# EAGLE schematic 526_AI_BLOCKS_Rev020001 (EAGLE 9.6.2)
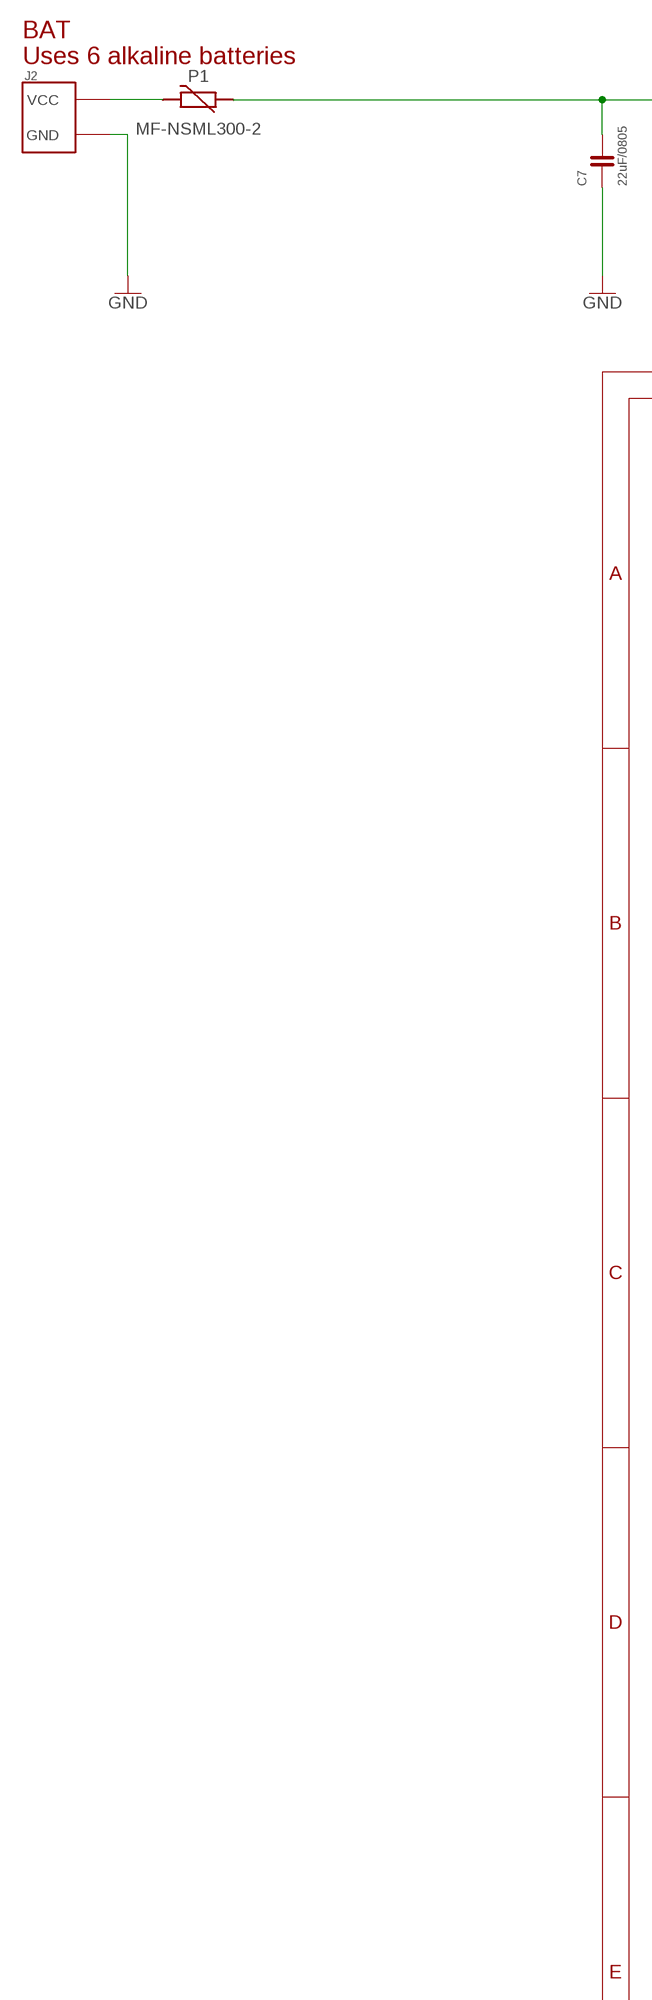
[diagram p0: schematic, sheet 1, part 1 of 2]
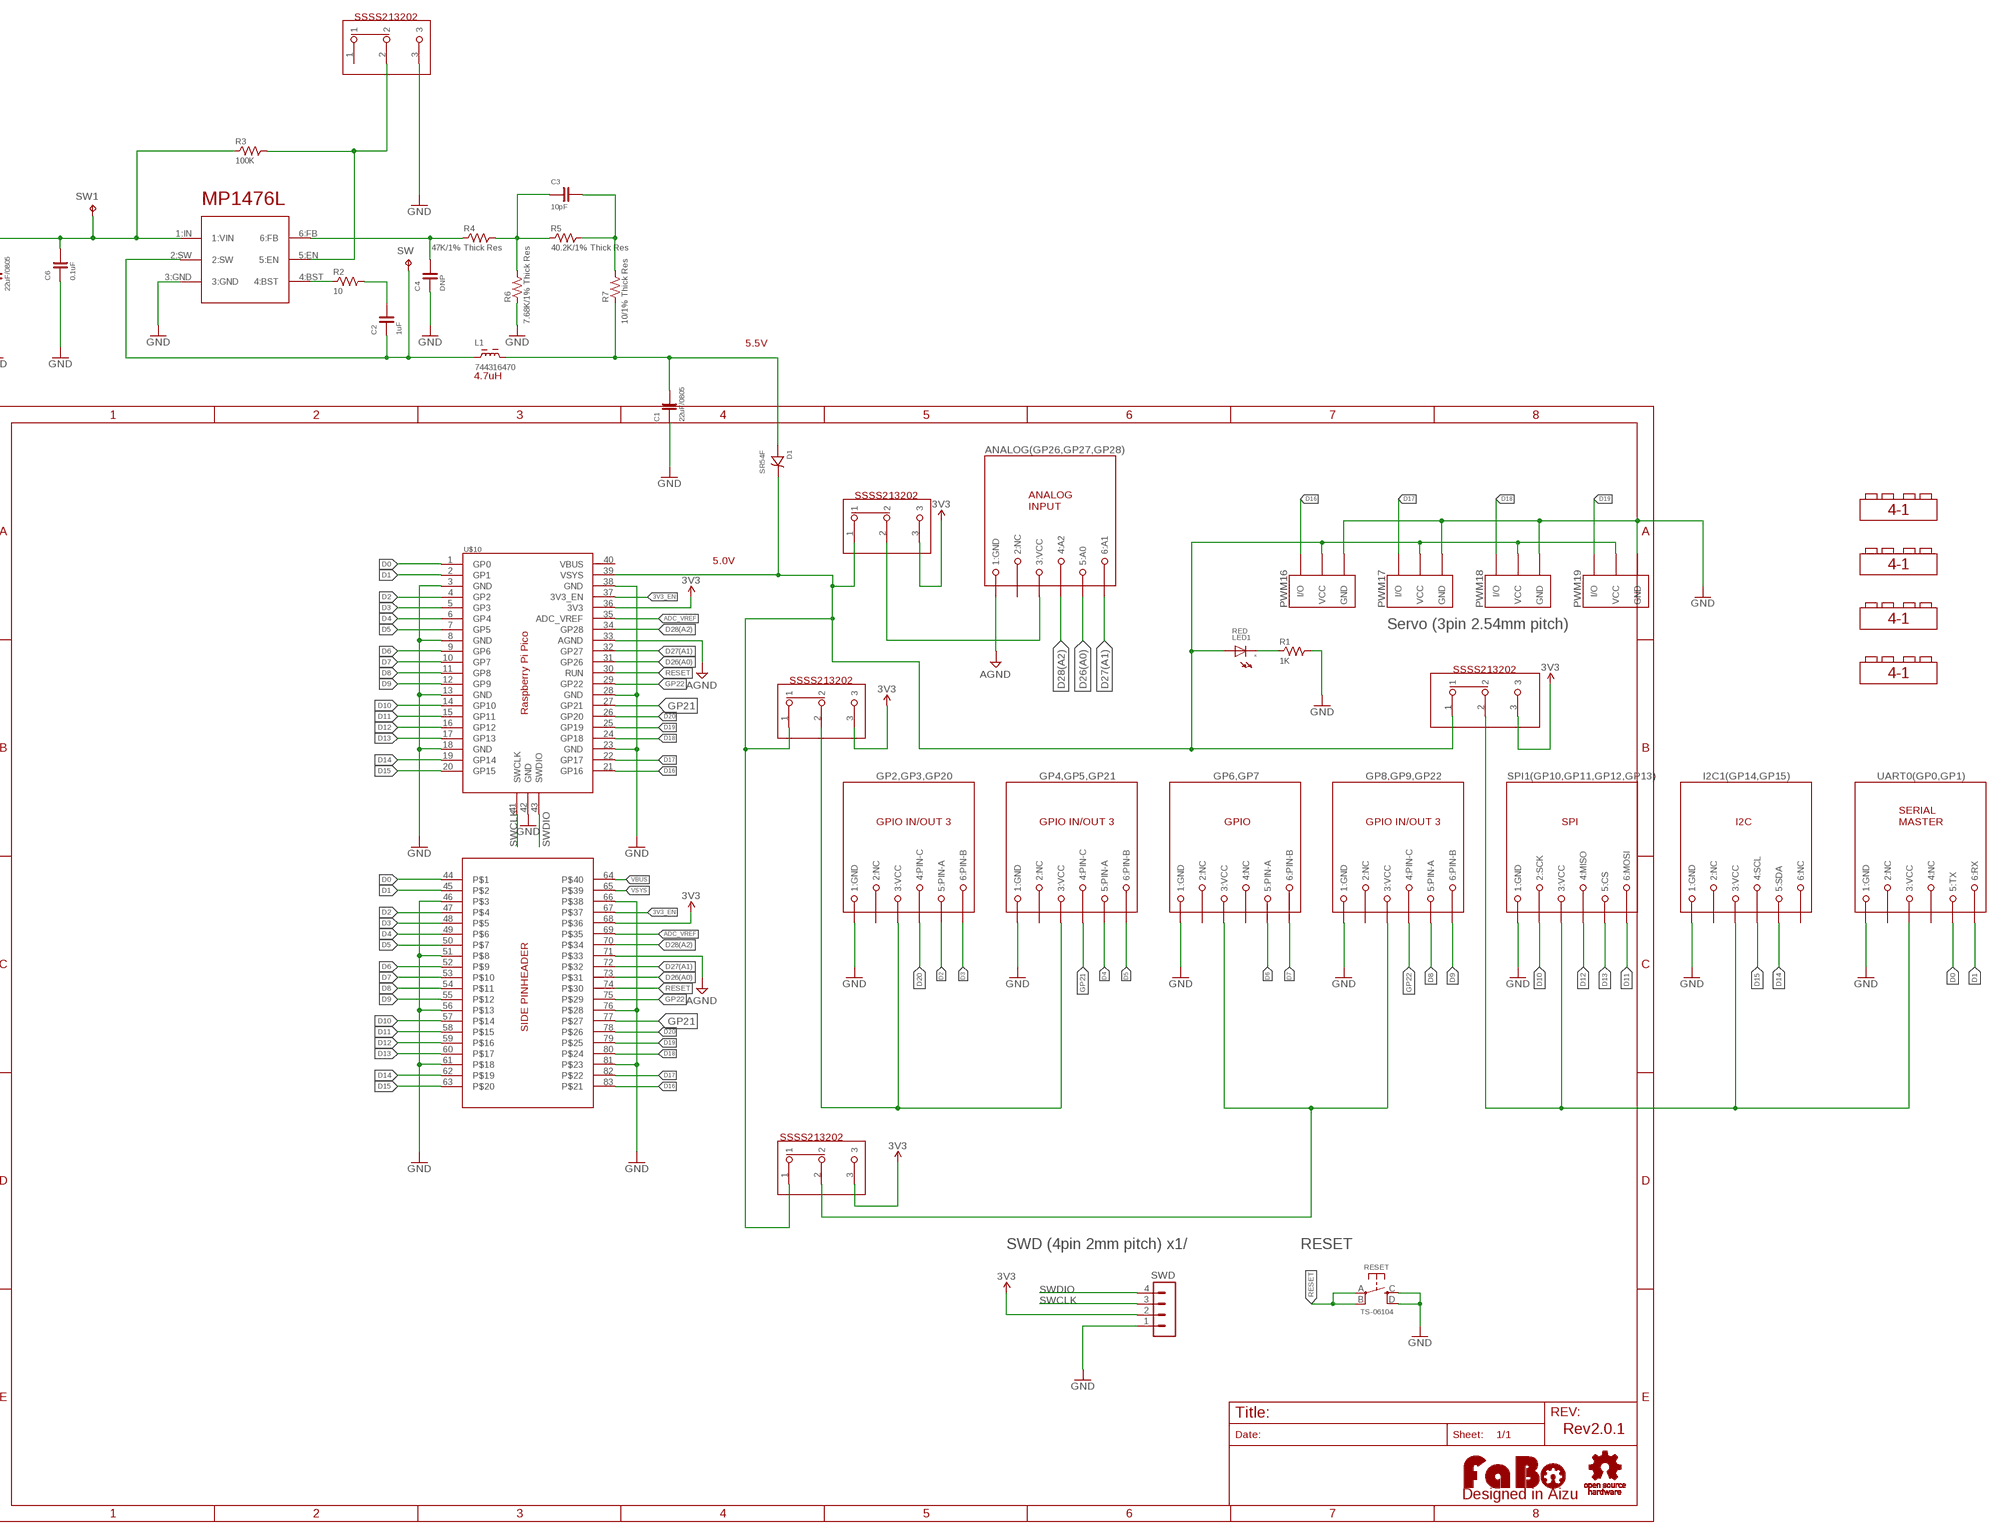
[diagram p1: schematic, sheet 1, part 2 of 2]

## Parts
ANALOG(GP26,GP27,GP28)  MODULAR-JACK-6P-RJ11_ANALOG3  [7002-6PXC-X]
C1  22uF/0805  CAPACITOR-0805  [0805]
C2  1uF  CAPACITOR-0603  [0603]
C3  10pF  CAPACITOR-0603  [0603]
C4  DNP  CAPACITOR-0603  [0603]
C6  0.1uF  CAPACITOR-0603  [0603]
C7  22uF/0805  CAPACITOR-0805  [0805]
D1  SR54F  [SMBF]
GP2,GP3,GP20  MODULAR-JACK-6P-RJ11_GPIO3  [7002-6PXC-X]
GP4,GP5,GP21  MODULAR-JACK-6P-RJ11_GPIO3  [7002-6PXC-X]
GP6,GP7  MODULAR-JACK-6P-RJ11_GPIO  [7002-6PXC-X]
GP8,GP9,GP22  MODULAR-JACK-6P-RJ11_GPIO3  [7002-6PXC-X]
I2C1(GP14,GP15)  MODULAR-JACK-6P-RJ11_I2C  [7002-6PXC-X]
J2  FABO_BRICK_2PIN  [FABO_BRICK_2PIN_B02B-PASK-1_SILK]
L1  744316470  [744316470]
LED1  RED  LED-0603  [0603]
LOGO1  LOGO_OSHW-M_BOTTOM  [LOGO_OSHW_M_BOTTOM]
LOGO2  LOGO_FABO-M  [LOGO_FABO_M]
P1  MF-NSML300-2  POLYSWITCH1206  [1206]
PWM16  FABO_BRICK_3PIN-HEADER  [FABO_BRICK_3PIN_HEADER]
PWM17  FABO_BRICK_3PIN-HEADER  [FABO_BRICK_3PIN_HEADER]
PWM18  FABO_BRICK_3PIN-HEADER  [FABO_BRICK_3PIN_HEADER]
PWM19  FABO_BRICK_3PIN-HEADER  [FABO_BRICK_3PIN_HEADER]
R1  1K  RESISTOR-0603  [0603]
R2  10  RESISTOR-0603  [0603]
R3  100K  RESISTOR-0603  [0603]
R4  47K/1% Thick Res  RESISTOR-0603  [0603]
R5  40.2K/1% Thick Res  RESISTOR-0603  [0603]
R6  7.68K/1% Thick Res  RESISTOR-0603  [0603]
R7  10/1% Thick Res  RESISTOR-0603  [0603]
RESET  TS-06104  [TS-06104]
SPI1(GP10,GP11,GP12,GP13)  MODULAR-JACK-6P-RJ11_SPI  [7002-6PXC-X]
SW  TPB1,27  [B1,27]
SW1  TPB1,27  [B1,27]
SWD  MA04-1  [MA04-1]
U2  MP1476L  [SOT563]
U$1  SSSS213202  [SSSS213202]
U$2  SSSS213202  [SSSS213202]
U$4  BLOCK_4-1  [4-1BLOCK]
U$5  BLOCK_4-1  [4-1BLOCK]
U$6  BLOCK_4-1  [4-1BLOCK]
U$7  BLOCK_4-1  [4-1BLOCK]
U$8  SSSS213202  [SSSS213202]
U$9  SSSS213202  [SSSS213202]
U$10  RASPBERRY_PI_PICO_BOTH_TH_PINHEADER  [RASPBERRY_PI_PICO_HEADER_BOTH]
U$11  SSSS213202  [SSSS213202]
UART0(GP0,GP1)  MODULAR-JACK-6P-RJ11_SERIAL_M  [7002-6PXC-X]

## Nets
3V3: SWD.2 U$1.3 U$2.3 U$8.3 U$9.3 U$10.36(3V3) U$10.68
3V3_EN: U$10.37(3V3_EN) U$10.67
5V: D1.CATHODE LED1.ANODE PWM16.VCC PWM17.VCC PWM18.VCC PWM19.VCC U$1.1 U$2.1 U$8.1 U$9.1 U$10.39(VSYS)
ADC_VREF: U$10.35(ADC_VREF) U$10.69
AGND: ANALOG(GP26,GP27,GP28).1(1:GND) U$10.33(AGND) U$10.71
D0: U$10.1(GP0) U$10.44 UART0(GP0,GP1).5(5:TX)
D1: U$10.2(GP1) U$10.45 UART0(GP0,GP1).6(6:RX)
D2: GP2,GP3,GP20.5(5:PIN-A) U$10.4(GP2) U$10.47
D3: GP2,GP3,GP20.6(6:PIN-B) U$10.5(GP3) U$10.48
D4: GP4,GP5,GP21.5(5:PIN-A) U$10.6(GP4) U$10.49
D5: GP4,GP5,GP21.6(6:PIN-B) U$10.7(GP5) U$10.50
D6: GP6,GP7.5(5:PIN-A) U$10.9(GP6) U$10.52
D7: GP6,GP7.6(6:PIN-B) U$10.10(GP7) U$10.53
D8: GP8,GP9,GP22.5(5:PIN-A) U$10.11(GP8) U$10.54
D9: GP8,GP9,GP22.6(6:PIN-B) U$10.12(GP9) U$10.55
D10: SPI1(GP10,GP11,GP12,GP13).2(2:SCK) U$10.14(GP10) U$10.57
D11: SPI1(GP10,GP11,GP12,GP13).6(6:MOSI) U$10.15(GP11) U$10.58
D12: SPI1(GP10,GP11,GP12,GP13).4(4:MISO) U$10.16(GP12) U$10.59
D13: SPI1(GP10,GP11,GP12,GP13).5(5:CS) U$10.17(GP13) U$10.60
D14: I2C1(GP14,GP15).5(5:SDA) U$10.19(GP14) U$10.62
D15: I2C1(GP14,GP15).4(4:SCL) U$10.20(GP15) U$10.63
D16: PWM16.I/O U$10.21(GP16) U$10.83
D17: PWM17.I/O U$10.22(GP17) U$10.82
D18: PWM18.I/O U$10.24(GP18) U$10.80
D19: PWM19.I/O U$10.25(GP19) U$10.79
D20: GP2,GP3,GP20.4(4:PIN-C) U$10.26(GP20) U$10.78
D26(A0): ANALOG(GP26,GP27,GP28).5(5:A0) U$10.31(GP26) U$10.73
D27(A1): ANALOG(GP26,GP27,GP28).6(6:A1) U$10.32(GP27) U$10.72
D28(A2): ANALOG(GP26,GP27,GP28).4(4:A2) U$10.34(GP28) U$10.70
GND: C1.1 C4.1 C6.1 C7.1 GP2,GP3,GP20.1(1:GND) GP4,GP5,GP21.1(1:GND) GP6,GP7.1(1:GND) GP8,GP9,GP22.1(1:GND) I2C1(GP14,GP15).1(1:GND) J2.GND1(GND) PWM16.GND PWM17.GND PWM18.GND PWM19.GND R1.2 R6.1 RESET.C RESET.D SPI1(GP10,GP11,GP12,GP13).1(1:GND) SWD.1 U2.3:GND U$10.3(GND) U$10.8(GND) U$10.13(GND) U$10.18(GND) U$10.23(GND) U$10.28(GND) U$10.38(GND) U$10.42(GND) U$10.46 U$10.51 U$10.56 U$10.61 U$10.66 U$10.76 U$10.81 U$11.3 UART0(GP0,GP1).1(1:GND)
GP21: GP4,GP5,GP21.4(4:PIN-C) U$10.27(GP21) U$10.77
GP22: GP8,GP9,GP22.4(4:PIN-C) U$10.29(GP22) U$10.75
IN_BAT1: J2.VCC P1.2
IN_BAT2: C6.2 C7.2 P1.1 R3.1 SW1.TP U2.1:IN(1:VIN)
N$1: LED1.CATHODE R1.1
N$2: ANALOG(GP26,GP27,GP28).3(3:VCC) U$1.2
N$3: I2C1(GP14,GP15).3(3:VCC) SPI1(GP10,GP11,GP12,GP13).3(3:VCC) U$8.2 UART0(GP0,GP1).3(3:VCC)
N$4: GP6,GP7.3(3:VCC) GP8,GP9,GP22.3(3:VCC) U$9.2
N$7: GP2,GP3,GP20.3(3:VCC) GP4,GP5,GP21.3(3:VCC) U$2.2
N$9: R2.1 U2.4:BST
N$10: C2.2 R2.2
N$11: C4.2 R4.1 U2.6:FB
N$13: C1.2 D1.ANODE L1.2 R7.1
N$14: C3.1 R4.2 R5.1 R6.2
N$15: C3.2 R5.2 R7.2
POWERON: R3.2 U2.5:EN U$11.2
RESET: RESET.A RESET.B U$10.30(RUN) U$10.74
SW_OUT: C2.1 L1.1 SW.TP U2.2:SW
SWCLK: SWD.3 U$10.41(SWCLK)
SWDIO: SWD.4 U$10.43(SWDIO)
VBUS: U$10.64
VSYS: U$10.65
Unconnected: ANALOG(GP26,GP27,GP28).2(2:NC) GP2,GP3,GP20.2(2:NC) GP4,GP5,GP21.2(2:NC) GP6,GP7.2(2:NC) GP6,GP7.4(4:NC) GP8,GP9,GP22.2(2:NC) I2C1(GP14,GP15).2(2:NC) I2C1(GP14,GP15).6(6:NC) U$10.40(VBUS) U$11.1 UART0(GP0,GP1).2(2:NC) UART0(GP0,GP1).4(4:NC)

## Notes on the sheet
- SSSS213202
- BAT 
  Uses 6 alkaline batteries
- 5.5V
- 4.7uH
- SSSS213202
- 5.0V
- Servo (3pin 2.54mm pitch)
- SSSS213202
- SSSS213202
- SSSS213202
- SWD (4pin 2mm pitch) x1/ | RESET
- Rev2.0.1

## Library data of the parts
ANALOG(GP26,GP27,GP28) = FaBo-Connetor:MODULAR-JACK-6P-RJ11_ANALOG3
C1-C4 C6 C7 = FaBo-Capacitor:CAPACITOR: CAPACITOR
D1 = FaBo-Diode:SR54F: SURFACE MOUNT SCHOTTKY BARRIER RECTIFIER 40V Volts 5 Amperes SMBF molded plastic Forwaord Voltage 0.55V DC Reverse Current 0.1mA
GP2,GP3,GP20 GP4,GP5,GP21 GP8,GP9,GP22 = FaBo-Connetor:MODULAR-JACK-6P-RJ11_GPIO3
GP6,GP7 = FaBo-Connetor:MODULAR-JACK-6P-RJ11_GPIO
I2C1(GP14,GP15) = FaBo-Connetor:MODULAR-JACK-6P-RJ11_I2C
J2 = FaBo-Template:FABO_BRICK_2PIN
L1 = FaBo-Coil:744316470
LED1 = FaBo-LED:LED
LOGO1 = FaBo-Logo:LOGO_OSHW
LOGO2 = FaBo-Logo:LOGO_FABO
P1 = FaBo-Supply:POLYSWITCH
PWM16-PWM19 = FaBo-Template:FABO_BRICK_3PIN: FaBo Brick 3pin
R1-R7 = FaBo-Resistors:RESISTOR: RESISTOR
RESET = FaBo-Switch:TS-06104
SPI1(GP10,GP11,GP12,GP13) = FaBo-Connetor:MODULAR-JACK-6P-RJ11_SPI
SW SW1 = testpad:TP: Test pad
SWD = con-lstb:MA04-1: PIN HEADER; OC_FARNELL: unknown; OC_NEWARK: unknown
U2 = FaBo-Supply:MP1476L
U$1 U$2 U$8 U$9 U$11 = FaBo-Switch:SSSS213202
U$4-U$7 = FaBo-Block:BLOCK_4-1
U$10 = FaBo-Boards:RASPBERRY_PI_PICO_BOTH_TH_PINHEADER
UART0(GP0,GP1) = FaBo-Connetor:MODULAR-JACK-6P-RJ11_SERIAL_M